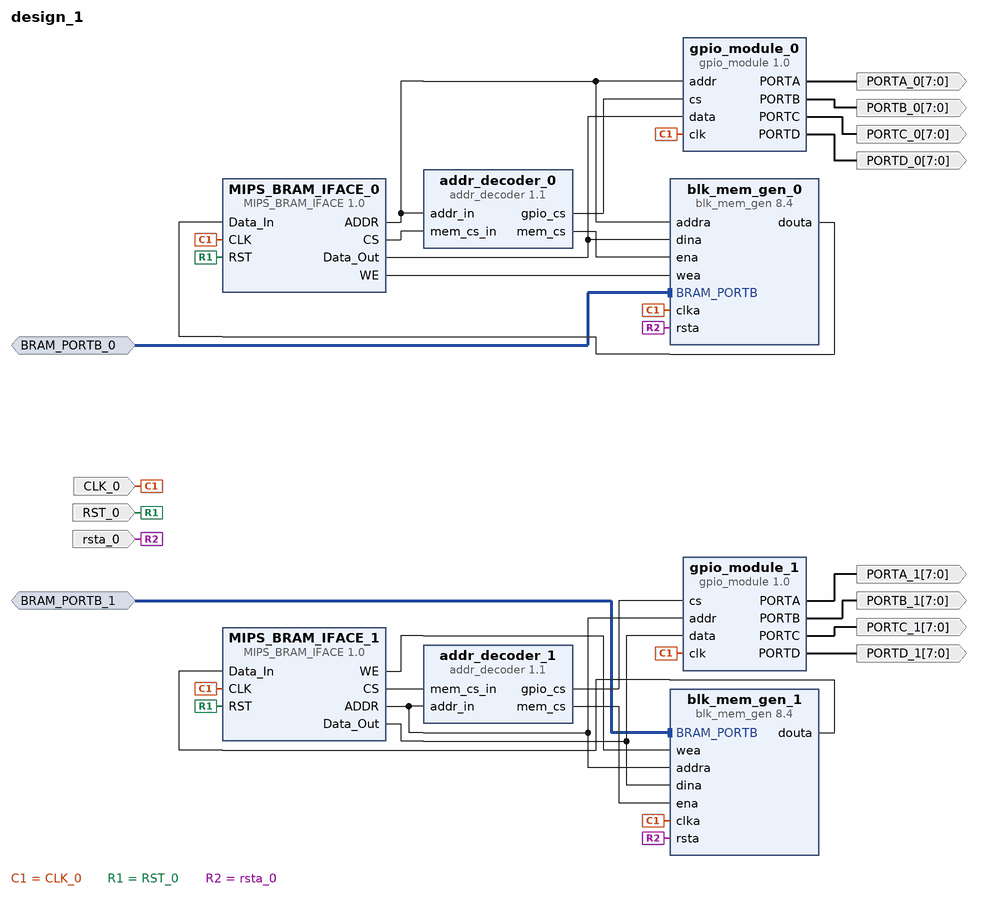
[diagram p0: block diagram of the top level]
# Vivado block design design_1, xc7z020clg484-1, Vivado 2020.1
create_bd_design design_1

create_bd_intf_port -mode Slave -vlnv xilinx.com:interface:bram_rtl:1.0 BRAM_PORTB_0
set_property -dict {CONFIG.MASTER_TYPE BRAM_CTRL CONFIG.READ_WRITE_MODE READ_WRITE} [get_bd_intf_ports BRAM_PORTB_0]
create_bd_intf_port -mode Slave -vlnv xilinx.com:interface:bram_rtl:1.0 BRAM_PORTB_1
set_property -dict {CONFIG.MASTER_TYPE BRAM_CTRL CONFIG.READ_WRITE_MODE READ_WRITE} [get_bd_intf_ports BRAM_PORTB_1]
create_bd_port -dir I -type clk CLK_0
create_bd_port -dir I -type rst RST_0
create_bd_port -dir I -type rst rsta_0
create_bd_port -dir O -from 7 -to 0 PORTA_0
create_bd_port -dir O -from 7 -to 0 PORTB_0
create_bd_port -dir O -from 7 -to 0 PORTC_0
create_bd_port -dir O -from 7 -to 0 PORTD_0
create_bd_port -dir O -from 7 -to 0 PORTA_1
create_bd_port -dir O -from 7 -to 0 PORTB_1
create_bd_port -dir O -from 7 -to 0 PORTC_1
create_bd_port -dir O -from 7 -to 0 PORTD_1

create_bd_cell -type ip -vlnv xilinx.com:ip:blk_mem_gen:8.4 blk_mem_gen_0
set_property -dict [list \
  CONFIG.EN_SAFETY_CKT true \
  CONFIG.Enable_32bit_Address true \
  CONFIG.Enable_B Use_ENB_Pin \
  CONFIG.Memory_Type True_Dual_Port_RAM \
  CONFIG.Port_B_Clock 100 \
  CONFIG.Port_B_Enable_Rate 100 \
  CONFIG.Port_B_Write_Rate 50 \
  CONFIG.Register_PortA_Output_of_Memory_Primitives false \
  CONFIG.Register_PortB_Output_of_Memory_Primitives false \
  CONFIG.Use_RSTA_Pin true \
  CONFIG.Use_RSTB_Pin true \
  CONFIG.use_bram_block BRAM_Controller \
] [get_bd_cells blk_mem_gen_0]
create_bd_cell -type ip -vlnv sdu.dk:user:MIPS_BRAM_IFACE:1.0 MIPS_BRAM_IFACE_0
create_bd_cell -type ip -vlnv sdu.dk:user:MIPS_BRAM_IFACE:1.0 MIPS_BRAM_IFACE_1
create_bd_cell -type ip -vlnv xilinx.com:ip:blk_mem_gen:8.4 blk_mem_gen_1
set_property -dict [list \
  CONFIG.EN_SAFETY_CKT true \
  CONFIG.Enable_32bit_Address true \
  CONFIG.Enable_B Use_ENB_Pin \
  CONFIG.Memory_Type True_Dual_Port_RAM \
  CONFIG.Port_B_Clock 100 \
  CONFIG.Port_B_Enable_Rate 100 \
  CONFIG.Port_B_Write_Rate 50 \
  CONFIG.Register_PortA_Output_of_Memory_Primitives false \
  CONFIG.Register_PortB_Output_of_Memory_Primitives false \
  CONFIG.Use_RSTA_Pin true \
  CONFIG.Use_RSTB_Pin true \
  CONFIG.use_bram_block BRAM_Controller \
] [get_bd_cells blk_mem_gen_1]
create_bd_cell -type ip -vlnv sdu.dk:user:gpio_module:1.0 gpio_module_0
create_bd_cell -type ip -vlnv sdu.dk:user:addr_decoder:1.1 addr_decoder_0
create_bd_cell -type ip -vlnv sdu.dk:user:gpio_module:1.0 gpio_module_1
create_bd_cell -type ip -vlnv sdu.dk:user:addr_decoder:1.1 addr_decoder_1

# ---- connections ----

connect_bd_intf_net -intf_net BRAM_PORTB_0_1 [get_bd_intf_ports BRAM_PORTB_0] [get_bd_intf_pins blk_mem_gen_0/BRAM_PORTB]
connect_bd_intf_net -intf_net BRAM_PORTB_1_1 [get_bd_intf_ports BRAM_PORTB_1] [get_bd_intf_pins blk_mem_gen_1/BRAM_PORTB]
connect_bd_net -net CLK_0_1 [get_bd_ports CLK_0] \
  [get_bd_pins MIPS_BRAM_IFACE_0/CLK] [get_bd_pins blk_mem_gen_0/clka] [get_bd_pins blk_mem_gen_1/clka] \
  [get_bd_pins MIPS_BRAM_IFACE_1/CLK] [get_bd_pins gpio_module_0/clk] [get_bd_pins gpio_module_1/clk]
connect_bd_net [get_bd_pins MIPS_BRAM_IFACE_0/ADDR] \
  [get_bd_pins blk_mem_gen_0/addra] [get_bd_pins addr_decoder_0/addr_in] [get_bd_pins gpio_module_0/addr]
connect_bd_net [get_bd_pins MIPS_BRAM_IFACE_0/Data_Out] [get_bd_pins blk_mem_gen_0/dina] [get_bd_pins gpio_module_0/data]
connect_bd_net [get_bd_pins blk_mem_gen_0/douta] [get_bd_pins MIPS_BRAM_IFACE_0/Data_In]
connect_bd_net -net RST_0_1 [get_bd_ports RST_0] [get_bd_pins MIPS_BRAM_IFACE_0/RST] [get_bd_pins MIPS_BRAM_IFACE_1/RST]
connect_bd_net [get_bd_pins MIPS_BRAM_IFACE_0/WE] [get_bd_pins blk_mem_gen_0/wea]
connect_bd_net -net rsta_0_1 [get_bd_ports rsta_0] [get_bd_pins blk_mem_gen_0/rsta] [get_bd_pins blk_mem_gen_1/rsta]
connect_bd_net [get_bd_pins MIPS_BRAM_IFACE_1/ADDR] \
  [get_bd_pins blk_mem_gen_1/addra] [get_bd_pins gpio_module_1/addr] [get_bd_pins addr_decoder_1/addr_in]
connect_bd_net [get_bd_pins MIPS_BRAM_IFACE_1/WE] [get_bd_pins blk_mem_gen_1/wea]
connect_bd_net [get_bd_pins MIPS_BRAM_IFACE_1/Data_Out] [get_bd_pins blk_mem_gen_1/dina] [get_bd_pins gpio_module_1/data]
connect_bd_net [get_bd_pins blk_mem_gen_1/douta] [get_bd_pins MIPS_BRAM_IFACE_1/Data_In]
connect_bd_net [get_bd_pins addr_decoder_0/gpio_cs] [get_bd_pins gpio_module_0/cs]
connect_bd_net [get_bd_pins addr_decoder_0/mem_cs] [get_bd_pins blk_mem_gen_0/ena]
connect_bd_net [get_bd_pins MIPS_BRAM_IFACE_0/CS] [get_bd_pins addr_decoder_0/mem_cs_in]
connect_bd_net [get_bd_pins addr_decoder_1/mem_cs] [get_bd_pins blk_mem_gen_1/ena]
connect_bd_net [get_bd_pins addr_decoder_1/gpio_cs] [get_bd_pins gpio_module_1/cs]
connect_bd_net [get_bd_pins MIPS_BRAM_IFACE_1/CS] [get_bd_pins addr_decoder_1/mem_cs_in]
connect_bd_net [get_bd_pins gpio_module_0/PORTA] [get_bd_ports PORTA_0]
connect_bd_net [get_bd_pins gpio_module_0/PORTB] [get_bd_ports PORTB_0]
connect_bd_net [get_bd_pins gpio_module_0/PORTC] [get_bd_ports PORTC_0]
connect_bd_net [get_bd_pins gpio_module_0/PORTD] [get_bd_ports PORTD_0]
connect_bd_net [get_bd_pins gpio_module_1/PORTA] [get_bd_ports PORTA_1]
connect_bd_net [get_bd_pins gpio_module_1/PORTB] [get_bd_ports PORTB_1]
connect_bd_net [get_bd_pins gpio_module_1/PORTC] [get_bd_ports PORTC_1]
connect_bd_net [get_bd_pins gpio_module_1/PORTD] [get_bd_ports PORTD_1]

validate_bd_design
save_bd_design
